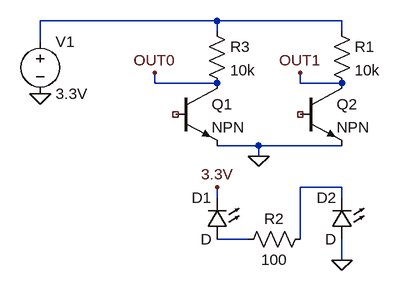
[diagram p0: schematic Sensores_reflexivos.asc]
Sensores_reflexivos.asc, the LTspice schematic file:
Version 4
SHEET 1 880 680
WIRE -16 -48 -288 -48
WIRE 176 -48 -16 -48
WIRE -16 -32 -16 -48
WIRE 176 -32 176 -48
WIRE -288 -16 -288 -48
WIRE -112 48 -112 32
WIRE -16 48 -112 48
WIRE 112 48 112 32
WIRE 176 48 112 48
WIRE 48 144 -16 144
WIRE 176 144 48 144
WIRE 48 160 48 144
WIRE 176 208 112 208
WIRE -16 224 -16 208
WIRE 176 224 176 208
WIRE 32 288 -16 288
WIRE 112 288 112 208
WIRE 176 320 176 288
WIRE 0 0 0 0
FLAG 48 160 0
FLAG 176 320 0
FLAG -16 208 3.3V
FLAG -288 64 0
FLAG -112 32 OUT0
FLAG 112 32 OUT1
SYMBOL LED 0 288 R180
WINDOW 0 24 64 Left 2
WINDOW 3 24 0 Left 2
SYMATTR InstName D1
SYMBOL voltage -288 -32 R0
WINDOW 123 0 0 Left 0
WINDOW 39 0 0 Left 0
SYMATTR InstName V1
SYMATTR Value 3.3V
SYMBOL res 160 -48 R0
SYMATTR InstName R1
SYMATTR Value 10k
SYMBOL npn -80 48 R0
SYMATTR InstName Q1
SYMBOL LED 192 288 R180
WINDOW 0 24 64 Left 2
WINDOW 3 24 0 Left 2
SYMATTR InstName D2
SYMBOL npn 112 48 R0
SYMATTR InstName Q2
SYMBOL res 128 272 R90
WINDOW 0 0 56 VBottom 2
WINDOW 3 32 56 VTop 2
SYMATTR InstName R2
SYMATTR Value 100
SYMBOL res -32 -48 R0
SYMATTR InstName R3
SYMATTR Value 10k

The netlist it stands for:
* Sensores_reflexivos.asc
D1 N003 3.3V D
V1 N001 0 3.3V
R1 N001 OUT1 10k
Q1 OUT0 NC_01 0 0 NPN
D2 0 N002 D
Q2 OUT1 NC_02 0 0 NPN
R2 N002 N003 100
R3 N001 OUT0 10k
.model D D
.lib standard.dio
.model NPN NPN
.model PNP PNP
.lib standard.bjt
.backanno
.end